# EAGLE design LSPACE-PCB (EAGLE 9.6.2)
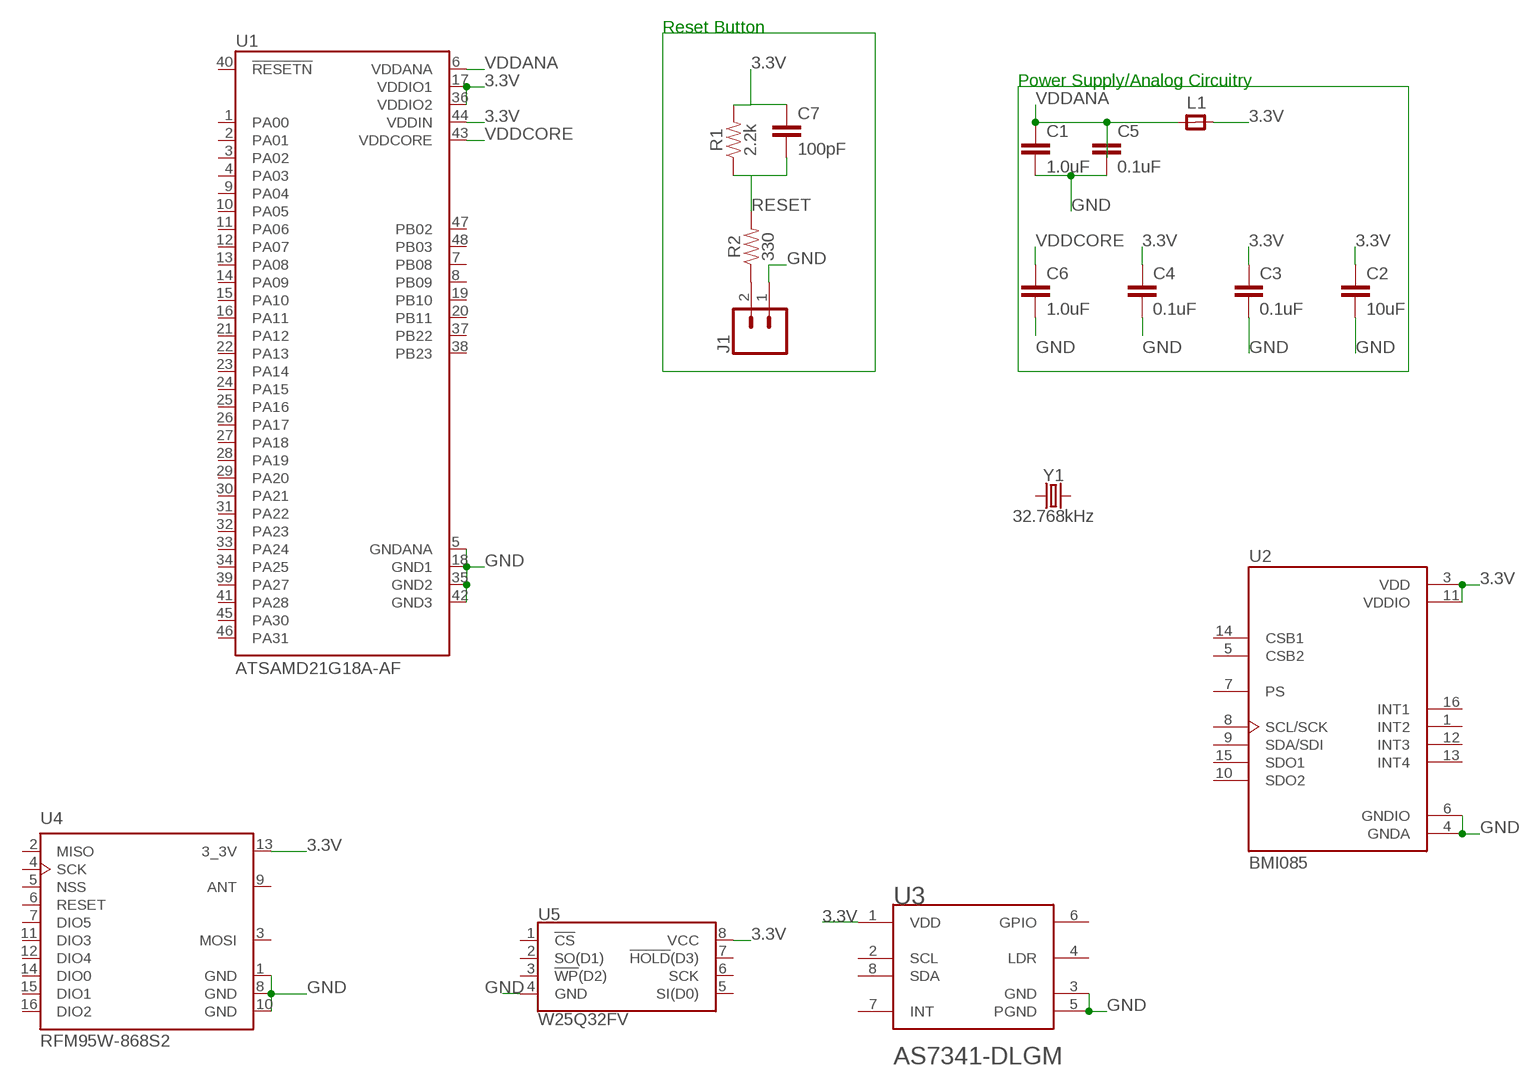
[diagram p0: schematic, sheet 1]

## Parts
C1  1.0uF  1.0UF-1206-50V-10%  [1206]
C2  10uF  10UF-1206-6.3V-20%  [1206]
C3  0.1uF  0.1UF-0603-100V-10%  [0603]
C4  0.1uF  0.1UF-0603-100V-10%  [0603]
C5  0.1uF  0.1UF-0603-100V-10%  [0603]
C6  1.0uF  1.0UF-1206-50V-10%  [1206]
C7  100pF  100PF-0603-50V-5%  [0603]
J1  CONN_02  [1X02]
L1  RC-MASTER-SMD_FB_1206MP  [RC-MASTER-SMD_L1206MP]
R1  2.2k  2.2KOHM-0603-1/10W-1%  [0603]
R2  330  330OHM-0603-1/10W-1%  [0603]
U1  ATSAMD21G18A-AF  [QFP50P900X900X120-48N]
U2  BMI085  [PQFN50P450X300X100-16N]
U3  AMS_AS7341-DLGMAMS_AS7341-DLGM_0_0  [AMS_AS7341-DLGM_0]
U4  RFM95W-868S2  [XCVR_RFM95W-868S2]
U5  W25Q32FV  W25Q32FVSS  [SOIC-8]
Y1  32.768kHz  CRYSTAL-32.768KHZSMD-3.2X1.5  [CRYSTAL-SMD-3.2X1.5MM]

## Nets
3.3V: C2.1 C3.1 C4.1 C7.1 L1.2 R1.2 U1.17(VDDIO1) U1.36(VDDIO2) U1.44(VDDIN) U2.3(VDD) U2.11(VDDIO) U3.1(VDD) U4.13(3_3V) U5.8(VCC)
GND: C1.2 C2.2 C3.2 C4.2 C5.2 C6.2 J1.1 U1.5(GNDANA) U1.18(GND1) U1.35(GND2) U1.42(GND3) U2.4(GNDA) U2.6(GNDIO) U3.3(GND) U3.5(PGND) U4.1(GND) U4.8(GND) U4.10(GND) U5.4(GND)
N$1: J1.2 R2.1
RESET: C7.2 R1.1 R2.2
VDDANA: C1.1 C5.1 L1.1 U1.6(VDDANA)
VDDCORE: C6.1 U1.43(VDDCORE)
Unconnected: U1.1(PA00) U1.2(PA01) U1.3(PA02) U1.4(PA03) U1.7(PB08) U1.8(PB09) U1.9(PA04) U1.10(PA05) U1.11(PA06) U1.12(PA07) U1.13(PA08) U1.14(PA09) U1.15(PA10) U1.16(PA11) U1.19(PB10) U1.20(PB11) U1.21(PA12) U1.22(PA13) U1.23(PA14) U1.24(PA15) U1.25(PA16) U1.26(PA17) U1.27(PA18) U1.28(PA19) U1.29(PA20) U1.30(PA21) U1.31(PA22) U1.32(PA23) U1.33(PA24) U1.34(PA25) U1.37(PB22) U1.38(PB23) U1.39(PA27) U1.40(!RESETN) U1.41(PA28) U1.45(PA30) U1.46(PA31) U1.47(PB02) U1.48(PB03) U2.1(INT2) U2.5(CSB2) U2.7(PS) U2.8(SCL/SCK) U2.9(SDA/SDI) U2.10(SDO2) U2.12(INT3) U2.13(INT4) U2.14(CSB1) U2.15(SDO1) U2.16(INT1) U3.2(SCL) U3.4(LDR) U3.6(GPIO) U3.7(INT) U3.8(SDA) U4.2(MISO) U4.3(MOSI) U4.4(SCK) U4.5(NSS) U4.6(RESET) U4.7(DIO5) U4.9(ANT) U4.11(DIO3) U4.12(DIO4) U4.14(DIO0) U4.15(DIO1) U4.16(DIO2) U5.1(!CS!) U5.2(SO(D1)) U5.3(!WP!(D2)) U5.5(SI(D0)) U5.6(SCK) U5.7(!HOLD!(D3)) Y1.P$1 Y1.P$2

## Notes on the sheet
- Reset Button
- Power Supply/Analog Circuitry

## Library data of the parts
C1 C6 = SparkFun-Capacitors:1.0UF: 1µF ceramic capacitors A capacitor is a passive two-terminal electrical component used to store electrical energy temporarily in an electric field.; PROD_ID: CAP-09822
C2 = SparkFun-Capacitors:10UF: 10.0µF ceramic capacitors A capacitor is a passive two-terminal electrical component used to store electrical energy temporarily in an electric field.; PROD_ID: CAP-10057
C3-C5 = SparkFun-Capacitors:0.1UF: 0.1µF ceramic capacitors A capacitor is a passive two-terminal electrical component used to store electrical energy temporarily in an electric field.; PROD_ID: CAP-08390
C7 = SparkFun-Capacitors:100PF: 100pF/0.1nF ceramic capacitors A capacitor is a passive two-terminal electrical component used to store electrical energy temporarily in an electric field.; PROD_ID: CAP-07883
J1 = SparkFun-Connectors:CONN_02: Multi connection point. Often used as Generic Header-pin footprint for 0.1 inch spaced/style header connections On any of the 0.1 inch spaced packages, you can populate with these: Break Away Headers - Straight <https://www.sparkfun.com/products/116> (PRT-00116) Break Away Male Headers - Right Angle <https://www.sparkfun.com/products/553> (PRT-00553) Female Headers <https://www.sparkfun.com/products/115> (PRT-00115) Break Away Headers - Machine Pin <https://www.sparkfun.com/products/117> (PRT-00117) Break Away Female Headers - Swiss Machine Pin <https://www.sparkfun.com/products/743> (PRT-00743) For SCREWTERMINALS and SPRING TERMINALS visit here: Screw Terimnals on SparkFun.com <https://www.sparkfun.com/search/results?term=Screw+Terminals> (5mm/3.5mm/2.54mm spacing) This device is also useful as a general connection point to wire up your design to another part of your project. Our various solder wires solder well into these plated through hole pads. Hook-Up Wire - Assortment (Stranded, 22 AWG) <https://www.sparkfun.com/products/11375> (PRT-11375) Hook-Up Wire - Assortment (Solid Core, 22 AWG) <https://www.sparkfun.com/products/11367> (PRT-11367) View the entire wire category on our website here <https://www.sparkfun.com/categories/141> Special notes: Molex polarized connector foot print use with: PRT-08233 with associated crimp pins and housings. 2.54_SCREWTERM for use with PRT-10571. 3.5mm Screw Terminal footprints for PRT-08084 5mm Screw Terminal footprints for use with PRT-08432
L1 = 52101-101-REV-A_v16:RC-MASTER-SMD_FB_: FERRITE BEAD
R1 = SparkFun-Resistors:2.2KOHM: 2.2kΩ resistor A resistor is a passive two-terminal electrical component that implements electrical resistance as a circuit element. Resistors act to reduce current flow, and, at the same time, act to lower voltage levels within circuits. - Wikipedia; PROD_ID: RES-08272
R2 = SparkFun-Resistors:330OHM: 330Ω resistor A resistor is a passive two-terminal electrical component that implements electrical resistance as a circuit element. Resistors act to reduce current flow, and, at the same time, act to lower voltage levels within circuits. - Wikipedia; PROD_ID: RES-00818
U1 = ATSAMD21G18A-AF:ATSAMD21G18A-AF: Cortex-M0+, 256KB FLASH, 32KB SRAM, USB, DMA, T&R - 48TQFP IND TEMP, GREEN, 1.6-3.6V, 48MHz Check availability <https://pricing.snapeda.com/parts/ATSAMD21G18A-AF/Microchip%20Technology%20/%20Atmel/view-part?ref=eda>; AVAILABILITY: In Stock; DESCRIPTION: ARM® Cortex®-M0+ Automotive, AEC-Q100, SAM D21G, Functional Safety (FuSa) Microcontroller IC 32-Bit 48MHz 256KB (256K x 8) FLASH 48-TQFP (7x7); MF: Microchip Technology / Atmel; MP: ATSAMD21G18A-AF; PACKAGE: None; PRICE: None; PURCHASE-URL: https://pricing.snapeda.com/search/part/ATSAMD21G18A-AF/?ref=eda
U2 = BMI085:BMI085: High-performance 6-axis IMU designed for Augmented/Virtual Reality applications Check availability <https://pricing.snapeda.com/parts/BMI085/Bosch%20Sensortec/view-part?ref=eda>; AVAILABILITY: In Stock; DESCRIPTION: Accelerometer, Gyroscope, 6 Axis Sensor I²C, SPI Output; MF: Bosch Sensortec; MP: BMI085; PACKAGE: VFLGA-16 Bosch Tools; PRICE: None; PURCHASE-URL: https://pricing.snapeda.com/search/part/BMI085/?ref=eda
U3 = ams - AS7341-DLGM:AMS_AS7341-DLGM: Light to Frequency Ambient Light Sensor Digital-I2C-OUT 8-Pin OLGA T/R; AMBIENT_TEMPERATURE_RANGE_HIGH: +70°C; AMBIENT_TEMPERATURE_RANGE_LOW: -30°C; AUTOMOTIVE: No; CENTROID_NOT_SPECIFIED: No; DATASHEET: https://media.digikey.com/pdf/Data%20Sheets/Austriamicrosystems%20PDFs/AS7341_DS.pdf; DEVICE_CLASS_L1: Sensors; DEVICE_CLASS_L2: Optical Sensors; DEVICE_CLASS_L3: unset; DIGIKEY_DESCRIPTION: SENSOR AMBIENT LIGHT; DIGIKEY_PART_NUMBER: AS7341-DLGMCT-ND; FOOTPRINT_VARIANT_NAME_0: Recommended_Land_Pattern; HEIGHT: 1.1mm; LEAD_FREE: Yes; MAX_SUPPLY_VOLTAGE: 2V; MF: ams; MFG_PACKAGE_IDENT: 0; MFG_PACKAGE_IDENT_DATE: 0; MFG_PACKAGE_IDENT_REV: 0; MIN_SUPPLY_VOLTAGE: 1.7V; MOUSER_DESCRIPTION: AS7341 Series 11-Channel Spectral Color Ambient Light Sensor - OLGA-8; MOUSER_PART_NUMBER: 985-AS7341-DLGM; MPN: AS7341-DLGM; OPERATING_SUPPLY_CURRENT: 0.7-210uA; PACKAGE: OLGA8; PIN_0_0_4_INSIDE_EDGE: clock; PREFIX: U; ROHS: Yes; SENSOR_OUTPUT: I2C; TEMPERATURE_RANGE_HIGH: +70°C; TEMPERATURE_RANGE_LOW: -30°C; VERIFICATION_VERSION: 0.0.0.3
U4 = RFM95W-868S2:RFM95W-868S2: Mod Txrx Lora +20dbm 868mhz Smd Check availability <https://pricing.snapeda.com/parts/RFM95W-868S2/RF/view-part?ref=eda>; AVAILABILITY: In Stock; DESCRIPTION: General ISM < 1GHz LoRa™ Transceiver Module 868MHz Antenna Not Included Surface Mount; MF: RF; MP: RFM95W-868S2; PACKAGE: SMD-16 Hope Microelectronics; PRICE: None; PURCHASE-URL: https://pricing.snapeda.com/search/part/RFM95W-868S2/?ref=eda
U5 = SparkFun-IC-Memory:W25Q32FV: W25Q32FV 32Mb (4MB) Serial Flash Memory The W25Q32FV support the standard Serial Peripheral Interface (SPI), Dual/Quad I/O SPI as well as 2-clocks instruction cycle Quad Peripheral Interface (QPI). 104MHz, SPI, 8-SOIC-EIAJ Datasheet <http://www.winbond.com/resource-files/w25q32fv%20revh%20091613.pdf> SparkFun Products SparkFun Blynk Board - ESP8266 <https://www.sparkfun.com/products/13794> (WRL-13794); PROD_ID: IC-13229
Y1 = SparkFun-Clocks:CRYSTAL-32.768KHZ: 32.768kHz Crystal Frequency: 32.768kHz Frequency Stability: ±20ppm Load Capacitance: 12.5pF (PTH-2X6 & SMD-3.2X1.5), 6pF (SMD-2X6) SparkFun Products: SparkFun BigTime Watch Kit <https://www.sparkfun.com/products/11734> SparkFun nRF52832 Breakout <https://www.sparkfun.com/products/13990> SparkFun Real Time Clock Module <https://www.sparkfun.com/products/12708>; PROD_ID: XTAL-13062

## Board
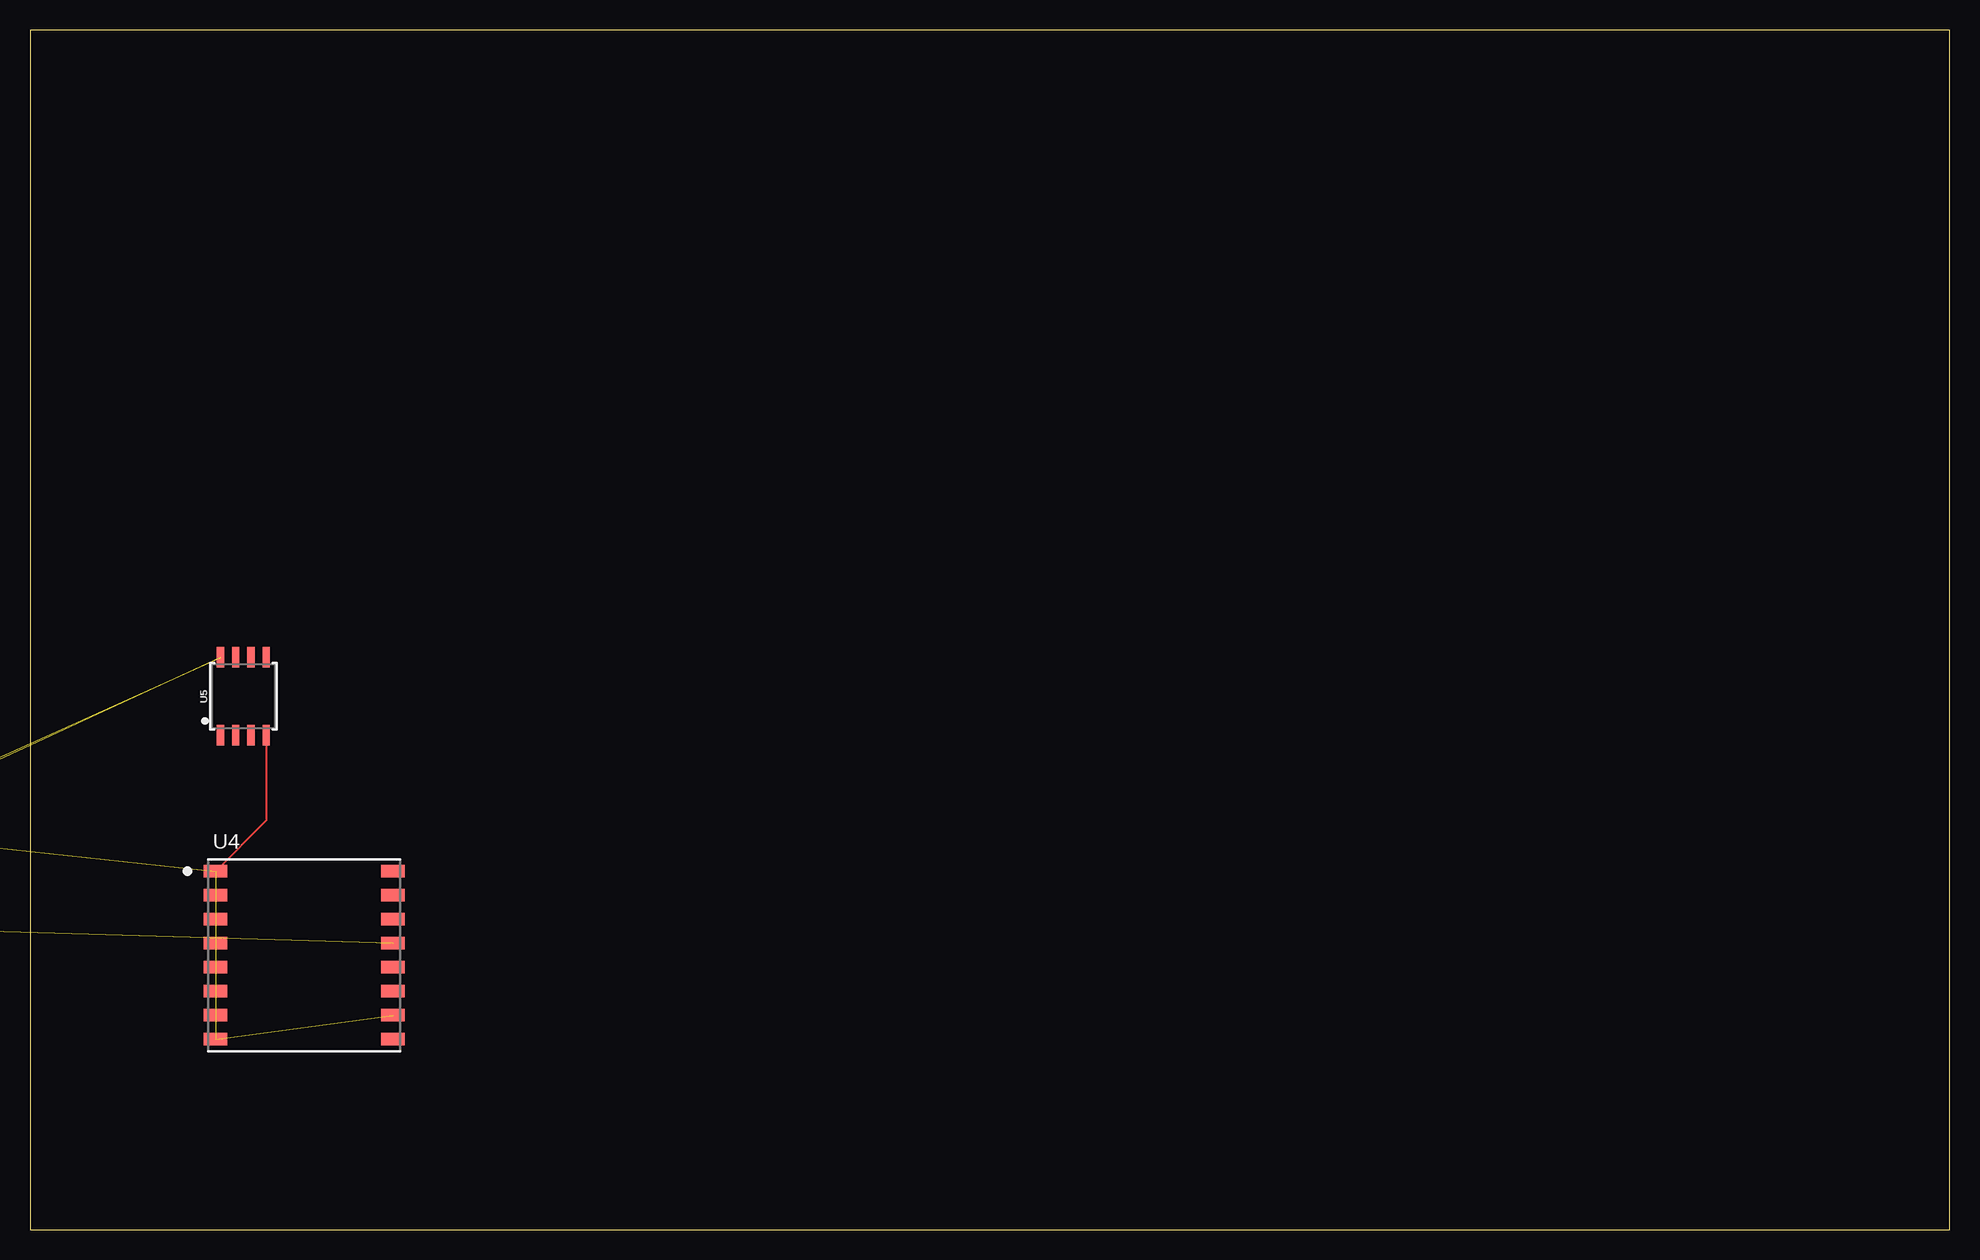
[diagram p1: board, top side]

Size 160 x 100 mm. Coordinates in mm from the lower left corner, seen from the top.
Outline: 0,0 160,0 160,100 0,100 0,0
Copper layers (1*16): Top 0.035mm / dielectric 1.5mm / Bottom 0.035mm
Design rules "default": minimum track width 6mil, minimum drill 0.35mm, track to track 6mil, track to pad 6mil, pad to pad 6mil, via to via 6mil, smd to smd 6mil, copper to edge 40mil, drill to drill 6mil, minimum pad ring 10mil, minimum via ring 8mil, stop-mask expansion 4mil, vias tented up to drill 0mil, thermal gap 10mil

### Footprints (pad centres in the part's own frame; a part is rotated, then mirrored left to right if it is on the bottom)
1206 = smd 1.6 x 1.8: 1 -1.4,0; 2 1.4,0
0603 = smd 1.1 x 1: 1 -0.85,0; 2 0.85,0
1X02 = drill 1.016 pad 1.88: 1 0,0; 2 2.54,0
RC-MASTER-SMD_L1206MP = smd 1.3 x 1.6: 1 -1.524,0; 2 1.524,0
QFP50P900X900X120-48N = smd 1.45 x 0.3: 1 -4.2,2.75; 2 -4.2,2.25; 3 -4.2,1.75; 4 -4.2,1.25; 5 -4.2,0.75; 6 -4.2,0.25; 7 -4.2,-0.25; 8 -4.2,-0.75; 9 -4.2,-1.25; 10 -4.2,-1.75; 11 -4.2,-2.25; 12 -4.2,-2.75; 25 4.17,-2.75; 26 4.2,-2.25; 27 4.2,-1.75; 28 4.2,-1.25; 29 4.2,-0.75; 30 4.2,-0.25; 31 4.2,0.25; 32 4.2,0.75; 33 4.2,1.25; 34 4.2,1.75; 35 4.2,2.25; 36 4.2,2.75 | smd 0.3 x 1.45: 13 -2.75,-4.2; 14 -2.25,-4.2; 15 -1.75,-4.2; 16 -1.25,-4.2; 17 -0.75,-4.2; 18 -0.25,-4.2; 19 0.25,-4.2; 20 0.75,-4.2; 21 1.25,-4.2; 22 1.75,-4.2; 23 2.25,-4.2; 24 2.75,-4.2; 37 2.75,4.2; 38 2.25,4.2; 39 1.75,4.2; 40 1.25,4.2; 41 0.75,4.2; 42 0.25,4.2; 43 -0.25,4.2; 44 -0.75,4.2; 45 -1.25,4.2; 46 -1.75,4.2; 47 -2.25,4.2; 48 -2.75,4.2
PQFN50P450X300X100-16N = smd 0.35 x 0.58: 1 -1.5,1.16; 2 -1,1.16; 3 -0.5,1.16; 4 0,1.16; 5 0.5,1.16; 6 1,1.16; 7 1.5,1.16; 9 1.5,-1.16; 10 1,-1.16; 11 0.5,-1.16; 12 0,-1.16; 13 -0.5,-1.16; 14 -1,-1.16; 15 -1.5,-1.16 | smd 0.58 x 0.35: 8 1.91,0; 16 -1.91,0
AMS_AS7341-DLGM_0 = smd 0.414 x 0.414: 1 -0.681,1.2 | smd 0.575 x 0.488: 2 -0.638,0.4; 3 -0.638,-0.4; 4 -0.638,-1.2; 5 0.638,-1.2; 6 0.638,-0.4; 7 0.638,0.4; 8 0.638,1.2
XCVR_RFM95W-868S2 = smd 1.95 x 1.05: 1 -7.4,7; 2 -7.4,5; 3 -7.4,3; 4 -7.4,1; 5 -7.4,-1; 6 -7.4,-3; 7 -7.4,-5; 8 -7.4,-7; 9 7.4,-7; 10 7.4,-5; 11 7.4,-3; 12 7.4,-1; 13 7.4,1; 14 7.4,3; 15 7.4,5; 16 7.4,7
SOIC-8 = smd 0.61 x 1.702: 1 -1.905,-3.251; 2 -0.635,-3.251; 3 0.635,-3.251; 4 1.905,-3.251; 5 1.905,3.251; 6 0.635,3.251; 7 -0.635,3.251; 8 -1.905,3.251
CRYSTAL-SMD-3.2X1.5MM = smd 1 x 1.8: P$1 -1.25,0; P$2 1.25,0

### Placement (x,y rotation side)
C1  -36.83,24.13 0 top  (outside the outline)
C2  -15.24,33.02 0 top  (outside the outline)
C3  -36.83,33.02 0 top  (outside the outline)
C4  -40.64,33.02 0 top  (outside the outline)
C5  -15.24,38.1 0 top  (outside the outline)
C6  -20.32,33.02 0 top  (outside the outline)
C7  -19.05,38.1 0 top  (outside the outline)
J1  -26.67,33.02 0 top  (outside the outline)
L1  -31.75,33.02 0 top  (outside the outline)
R1  -22.86,38.1 0 top  (outside the outline)
R2  -26.67,38.1 0 top  (outside the outline)
U1  -38.1,7.62 0 top  (outside the outline)
U2  -26.67,26.67 0 top  (outside the outline)
U3  -31.75,25.4 0 top  (outside the outline)
U4  22.86,22.86 0 top
U5  17.78,44.45 0 top
Y1  -45.72,2.54 0 top  (outside the outline)

### Tracks (layer width: path | path; a pad name or v marks a point on that pad's centre or on a via)
3.3V  (13 unrouted)
GND  (17 unrouted)
  Top 0.152: U5.4 19.68,34.09 U4.1
N$1  (1 unrouted)
RESET  (2 unrouted)
VDDANA  (3 unrouted)
VDDCORE  (1 unrouted)